# Altium schematic sheet a4_top_dsn.SchDoc
size A4; Date: 1/11/16; Engineer: JBayalas; DocumentNumber: 3; Revision: V1.0; SheetNumber: 3; SheetTotal: 11
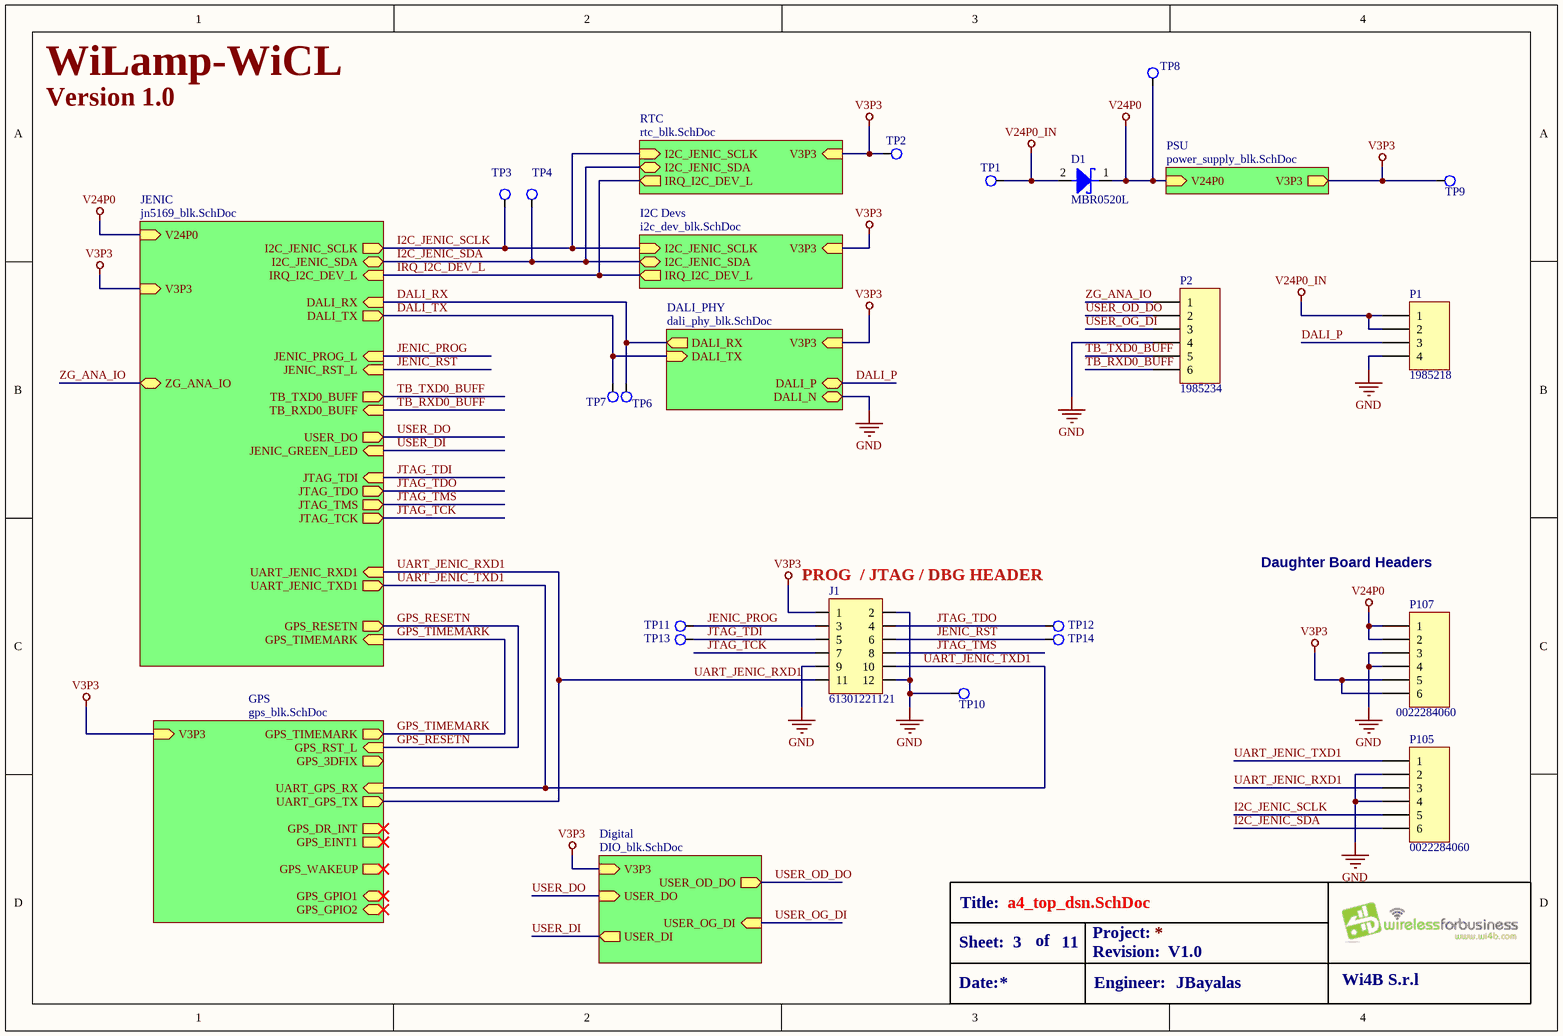
[diagram p0: a4_top_dsn.SchDoc]

## Parts
D1  MBR0520L  [SOD123]
J1  value 61301221121  [61301221121]  (hidden comment: *)
P1  1985218  [1985218 (4pin)]
P2  1985234  [1985234 (6 PIN)]
P105  0022284060  [HDR1X6]
P107  0022284060  [HDR1X6]
TP1  Test Point_2mm  [Test Point 2mm]  (value not drawn)
TP2  Test Point_2mm  [Test Point 2mm]  (value not drawn)
TP3  Test Point_2mm  [Test Point 2mm]  (value not drawn)
TP4  Test Point_2mm  [Test Point 2mm]  (value not drawn)
TP6  Test Point_2mm  [Test Point 2mm]  (value not drawn)
TP7  Test Point_2mm  [Test Point 2mm]  (value not drawn)
TP8  Test Point_3mm  [Test Point 3mm]  (value not drawn)
TP9  Test Point_3mm  [Test Point 3mm]  (value not drawn)
TP10  Test Point_3mm  [Test Point 3mm]  (value not drawn)
TP11  Test Point_3mm  [Test Point 3mm]  (value not drawn)
TP12  Test Point_3mm  [Test Point 3mm]  (value not drawn)
TP13  Test Point_3mm  [Test Point 3mm]  (value not drawn)
TP14  Test Point_3mm  [Test Point 3mm]  (value not drawn)

## Sub-sheets
DALI_PHY = dali_phy_blk.SchDoc: V3P3 (in), DALI_TX (in), DALI_RX (out), DALI_P (bidir), DALI_N (bidir)
Digital = DIO_blk.SchDoc: USER_DO (in), V3P3 (in), USER_DI (out), USER_OD_DO (out), USER_OG_DI (in)
GPS = gps_blk.SchDoc: UART_GPS_TX (out), UART_GPS_RX (in), V3P3 (in), GPS_RST_L (in), GPS_DR_INT (out), GPS_EINT1 (out), GPS_3DFIX (out), GPS_TIMEMARK (out), GPS_WAKEUP (out), GPS_GPIO1 (bidir), GPS_GPIO2 (bidir)
I2C Devs = i2c_dev_blk.SchDoc: I2C_JENIC_SDA (bidir), I2C_JENIC_SCLK (in), V3P3 (in), IRQ_I2C_DEV_L (out)
JENIC = jn5169_blk.SchDoc: V3P3 (in), JENIC_PROG_L (in), UART_JENIC_TXD1 (out), UART_JENIC_RXD1 (in), I2C_JENIC_SDA (bidir), I2C_JENIC_SCLK (out), ZG_ANA_IO (bidir), IRQ_I2C_DEV_L (in), GPS_RESETN (out), GPS_TIMEMARK (in), JENIC_RST_L (in), V24P0 (in), DALI_RX (in), DALI_TX (out), JTAG_TDI (in), JTAG_TDO (out), JTAG_TMS (out), JTAG_TCK (out), TB_RXD0_BUFF (in), TB_TXD0_BUFF (out), JENIC_GREEN_LED (in), USER_DO (out)
PSU = power_supply_blk.SchDoc: V3P3 (out), V24P0 (in)
RTC = rtc_blk.SchDoc: V3P3 (in), I2C_JENIC_SCLK (in), I2C_JENIC_SDA (bidir), IRQ_I2C_DEV_L (out)

## Nets
GND: J1.2 J1.9 J1.12 P1.4 P2.4 P105.2 P105.4 P107.3 P107.4 TP10.1 ; sheet DALI_PHY/DALI_N
V3P3: J1.1 P107.5 P107.6 TP2.1 TP9.1 ; sheet DALI_PHY/V3P3, sheet PSU/V3P3, sheet I2C Devs/V3P3, sheet GPS/V3P3, sheet JENIC/V3P3, sheet RTC/V3P3, sheet Digital/V3P3
V24P0: D1.1(cathode) P107.1 P107.2 TP8.1 ; sheet PSU/V24P0, sheet JENIC/V24P0
V24P0_IN: D1.2(anode) P1.1 P1.2 TP1.1
DALI_P: P1.3 ; sheet DALI_PHY/DALI_P
DALI_RX: TP6.1 ; sheet DALI_PHY/DALI_RX, sheet JENIC/DALI_RX
DALI_TX: TP7.1 ; sheet DALI_PHY/DALI_TX, sheet JENIC/DALI_TX
GPS_RESETN: sheet GPS/GPS_RST_L, sheet JENIC/GPS_RESETN
GPS_TIMEMARK: sheet GPS/GPS_TIMEMARK, sheet JENIC/GPS_TIMEMARK
I2C_JENIC_SCLK: P105.5 TP3.1 ; sheet I2C Devs/I2C_JENIC_SCLK, sheet JENIC/I2C_JENIC_SCLK, sheet RTC/I2C_JENIC_SCLK
I2C_JENIC_SDA: P105.6 TP4.1 ; sheet I2C Devs/I2C_JENIC_SDA, sheet JENIC/I2C_JENIC_SDA, sheet RTC/I2C_JENIC_SDA
IRQ_I2C_DEV_L: sheet I2C Devs/IRQ_I2C_DEV_L, sheet JENIC/IRQ_I2C_DEV_L, sheet RTC/IRQ_I2C_DEV_L
JENIC_PROG: J1.3 TP11.1 ; sheet JENIC/JENIC_PROG_L
JENIC_RST: J1.6 TP14.1 ; sheet JENIC/JENIC_RST_L
JTAG_TCK: J1.7 ; sheet JENIC/JTAG_TCK
JTAG_TDI: J1.5 TP13.1 ; sheet JENIC/JTAG_TDI
JTAG_TDO: J1.4 TP12.1 ; sheet JENIC/JTAG_TDO
JTAG_TMS: J1.8 ; sheet JENIC/JTAG_TMS
TB_RXD0_BUFF: P2.6 ; sheet JENIC/TB_RXD0_BUFF
TB_TXD0_BUFF: P2.5 ; sheet JENIC/TB_TXD0_BUFF
UART_JENIC_RXD1: J1.11 P105.3 ; sheet GPS/UART_GPS_TX, sheet JENIC/UART_JENIC_RXD1
UART_JENIC_TXD1: J1.10 P105.1 ; sheet GPS/UART_GPS_RX, sheet JENIC/UART_JENIC_TXD1
USER_DI: sheet JENIC/JENIC_GREEN_LED, sheet Digital/USER_DI
USER_DO: sheet JENIC/USER_DO, sheet Digital/USER_DO
USER_OD_DO: P2.2 ; sheet Digital/USER_OD_DO
USER_OG_DI: P2.3 ; sheet Digital/USER_OG_DI
ZG_ANA_IO: P2.1 ; sheet JENIC/ZG_ANA_IO

## Notes on the sheet
- Version 1.0
- WiLamp-WiCL
- (near J1) PROG  / JTAG / DBG HEADER
- Daughter Board Headers
- Title:
- Sheet:
- Date:
- of
- Project:
- Revision:
- Engineer:
- Wi4B S.r.l

## Library data of the parts
D1 = MBR0520L: DIODE SCHOTTKY 20V 0.5A SOD123; Manufacturer: Fairchild Semiconductor; Current - Average Rectified (Io): 500mA; Voltage - Forward (Vf) (Max) @ If: 385mV @ 500mA; Speed: Fast Recovery =< 500ns, > 200mA (Io); Current - Reverse Leakage @ Vr: 250µA @ 20V; Capacitance: 2.2µF; Tolerance: ±20%; Voltage - Rated: 100V; Temperature Coefficient: X7S; Supplier 1: Digi-Key; RoHS: RoHS Compliant; Category: Discrete Semiconductor Products; Stock 1: 251227; Pricing 1: 1=0.26, 10=0.232, 25=0.1668, 100=0.1297, 250=0.08152, 500=0.06946, 1000=0.04732 (GBP); Packaging: Cut Tape (CT); Diode Type: Schottky; Voltage - DC Reverse (Vr) (Max): 20V; Reverse Recovery Time (trr): -; Capacitance @ Vr, F: -; Mounting Type: Surface Mount; Package / Case: SOD-123; Supplier Device Package: SOD-123; Operating Temperature - Junction: -65°C ~ 125°C; ComponentLink1URL: http://www.fairchildsemi.com/datasheets/MB/MBR0520L.pdf; ComponentLink1Description: http://www.fairchildsemi.com/datasheets/MB/MBR0520L.pdf; Supplier Part Number 1: MBR0520LCT-ND; Supplier 2: Digi-Key; Stock 2: 9462; Pricing 2: 1=0.84, 10=0.804, 100=0.39, 250=0.324, 500=0.294, 1000=0.27 (USD); Operating Temperature: -55°C ~ 125°C; Applications: Automotive; Ratings: AEC-Q200; Size / Dimension: 0.126" L x 0.063" W (3.20mm x 1.60mm); Height - Seated (Max): -; Thickness (Max): 0.071" (1.80mm); Lead Spacing: -; Features: -; Lead Style: -; ComponentLink2URL: https://product.tdk.com/info/en/catalog/datasheets/mlcc_automotive_midvoltage_en.pdf; ComponentLink2Description: https://product.tdk.com/info/en/catalog/datasheets/mlcc_automotive_midvoltage_en.pdf; Manufacturer Part Number: MBR0520L
J1 = 61301221121: CONN HEADER VERT 12POS 2.54MM; MFT: Wurth Electronics; MPN: 61301221121; TYPE: TH; RATING: *; LOAD: *
P1 = 1985218: Fixed Terminal Blocks PTSA 1.5/4-3.5-Z; MFT: Phoenix Contact; TYPE: Through Hole; VALUE: 1985218; MPN: 1985218
P2 = 1985234: TERM BLOCK PCB 6POS 3.5MM GREEN; MFT: Phoenix Contact; TYPE: Through Hole; VALUE: 1985234; MPN: 1985234
P105 P107 = 0022284060: CONN HEADER 6POS .100 VERT TIN; MFT: Molex Inc; FUNCTION: TOP; TYPE: TH; VALUE: 0022284060; RATING: *; LOAD: *; MPN: 0022284060
TP1-TP4 TP6 TP7 = Test Point_2mm: Test Point 2mm
TP8-TP14 = Test Point_3mm: Test Point 3mm